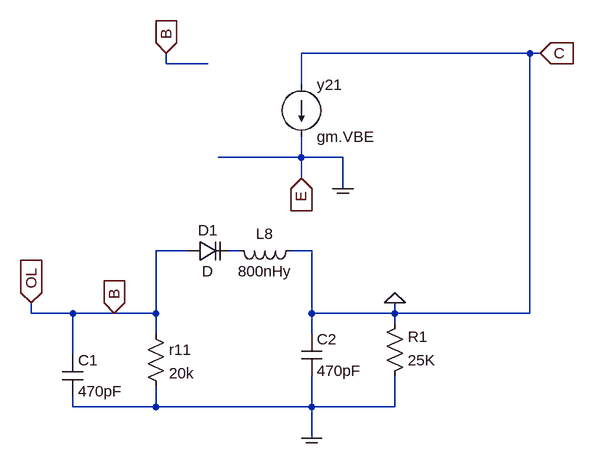
[diagram p0: schematic oscilador_res_b.asc]
oscilador_res_b.asc, the LTspice schematic file:
Version 4
SHEET 1 880 800
WIRE 160 -288 -192 -288
WIRE 176 -288 160 -288
WIRE -400 -272 -400 -288
WIRE -336 -272 -400 -272
WIRE -192 -240 -192 -288
WIRE -192 -128 -192 -160
WIRE -192 -128 -320 -128
WIRE -128 -128 -192 -128
WIRE -192 -96 -192 -128
WIRE -128 -80 -128 -128
WIRE -368 16 -416 16
WIRE -288 16 -304 16
WIRE -176 16 -208 16
WIRE -608 112 -608 96
WIRE -544 112 -608 112
WIRE -480 112 -544 112
WIRE -416 112 -416 16
WIRE -416 112 -480 112
WIRE -176 112 -176 16
WIRE -48 112 -48 96
WIRE -48 112 -176 112
WIRE 160 112 160 -288
WIRE 160 112 -48 112
WIRE -48 128 -48 112
WIRE -416 144 -416 112
WIRE -176 144 -176 112
WIRE -544 176 -544 112
WIRE -544 256 -544 240
WIRE -416 256 -416 224
WIRE -416 256 -544 256
WIRE -176 256 -176 208
WIRE -176 256 -416 256
WIRE -48 256 -48 208
WIRE -48 256 -176 256
WIRE -176 304 -176 256
FLAG -48 96 0
FLAG -400 -288 B
IOPIN -400 -288 In
FLAG -480 112 B
IOPIN -480 112 In
FLAG 176 -288 C
IOPIN 176 -288 In
FLAG -192 -96 E
IOPIN -192 -96 In
FLAG -128 -80 COM
FLAG -176 304 COM
FLAG -608 96 OL
IOPIN -608 96 In
SYMBOL cap -560 176 R0
SYMATTR InstName C1
SYMATTR Value 470pF
SYMBOL cap -192 208 M180
WINDOW 0 24 56 Left 2
WINDOW 3 24 8 Left 2
SYMATTR InstName C2
SYMATTR Value 470pF
SYMBOL ind -192 0 R90
WINDOW 0 5 56 VBottom 2
WINDOW 3 32 56 VTop 2
SYMATTR InstName L8
SYMATTR Value 800nHy
SYMBOL res -64 224 M180
WINDOW 0 36 76 Left 2
WINDOW 3 36 40 Left 2
SYMATTR InstName R1
SYMATTR Value 25K
SYMBOL res -432 128 R0
SYMATTR InstName r11
SYMATTR Value 20k
SYMBOL current -192 -240 R0
WINDOW 123 0 0 Left 0
WINDOW 39 0 0 Left 0
SYMATTR InstName y21
SYMATTR Value gm.VBE
SYMBOL varactor -368 32 R270
WINDOW 0 32 32 VTop 2
WINDOW 3 0 32 VBottom 2
SYMATTR InstName D1

The netlist it stands for:
* oscilador_res_b.asc
C1 OL COM 470pF
C2 COM 0 470pF
L8 0 N001 800nHy
R1 COM 0 25K
r11 OL COM 20k
I§y21 0 COM gm.VBE
D1 OL N001 D
.model D D
.lib standard.dio
.backanno
.end